# Altium schematic sheet REDS_IO.SchDoc
size A; SheetNumber: 12; SheetTotal: 12
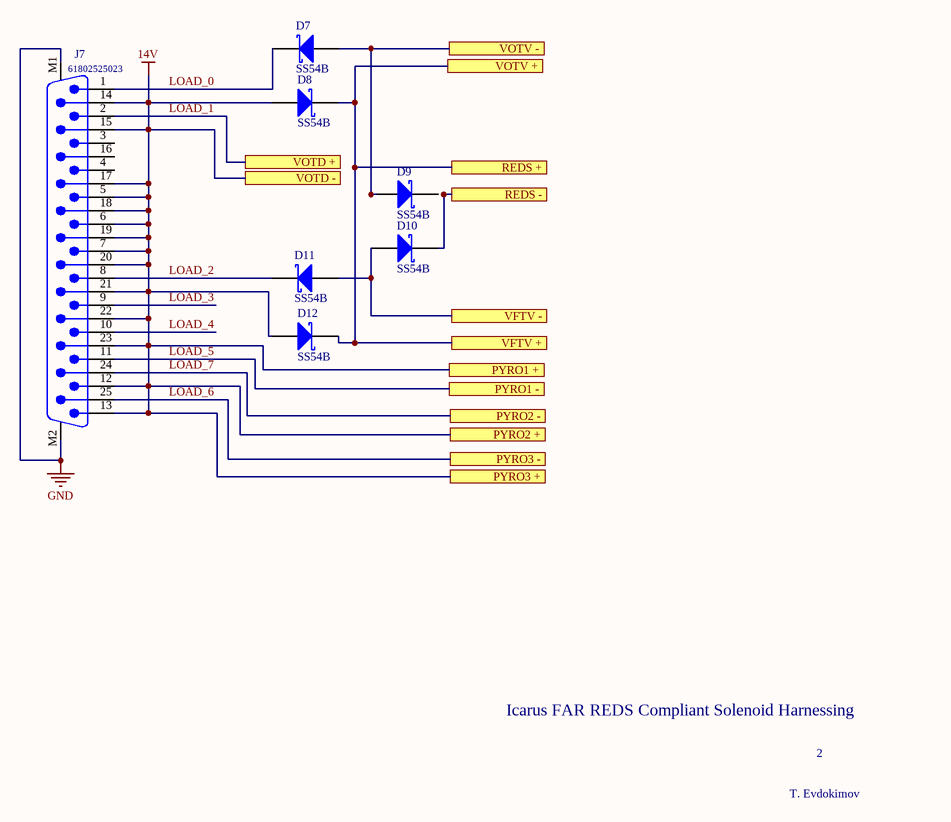
[diagram p0: REDS_IO.SchDoc]

## Parts
D7  SS54B  [JCET-SMB-2_M]
D8  SS54B  [JCET-SMB-2_M]
D9  SS54B  [JCET-SMB-2_M]
D10  SS54B  [JCET-SMB-2_M]
D11  SS54B  [JCET-SMB-2_M]
D12  SS54B  [JCET-SMB-2_M]
J7  61802525023  [61802525023]

## Ports
PYRO1 +, PYRO1 -, PYRO2 +, PYRO2 -, PYRO3 +, PYRO3 -, REDS +, REDS -, VFTV +, VFTV -, VOTD +, VOTD -, VOTV +, VOTV -

## Nets
14V: D8.1(A) D12.1(A) J7.5 J7.6 J7.7 J7.12 J7.13 J7.14 J7.15 J7.17 J7.18 J7.19 J7.20 J7.21 J7.22 J7.23 ; port VOTD -, port PYRO1 +, port PYRO2 +, port PYRO3 +
GND: J7.M1 J7.M2
LOAD_0: D7.2(K) J7.1
LOAD_1: J7.2 ; port VOTD +
LOAD_2: D11.2(K) J7.8
LOAD_3: J7.9
LOAD_4: J7.10
LOAD_5: J7.11 ; port PYRO1 -
LOAD_6: J7.25 ; port PYRO3 -
LOAD_7: J7.24 ; port PYRO2 -
REDS +: D8.2(K) D12.2(K) ; port VOTV +, port VFTV +, port REDS +
REDS -: D10.2(K) ; port REDS -
VFTV -: D10.1(A) D11.1(A) ; port VFTV -
VOTV -: D7.1(A) D9.1(A) ; port VOTV -

Not connected (* = marked no-connect by the designer): D9 2(K); J7 3 4 16

## Notes on the sheet
- Icarus FAR REDS Compliant Solenoid Harnessing
- 2
- T. Evdokimov

## Library data of the parts
D7-D12 = CMP-004-00006-2: Schottky Barrier Rectifier, 40 V, 5 A, -55 to 150 degC, 2-Pin SMD; Manufacturer: JCET; Datasheet URL: http://wiki.seeedstudio.com/images/3/3f/0310130P1.pdf; Datasheet Version: May-13; Package Reference: SMB-2; RoHS Compliant: Unknown; Manufacturer URL: http://www.cj-elec.com/; Mounting Technology: SM; Package Description: 2-Pin Surface Mount Device, Body 4.315 x 3.62 mm; Case/Package: SMB-2
J7 = CMP-1502-00278-1: Male PCB Connector WR-DSUB, Vertical, 25 pins; Manufacturer: Wurth Elektronik; Working Voltage: 125VAC; Rated Current: 3A; Pin Number: 25; Contact Resistance: 30mOhm; Operating Temperature: -40to85degC; Gender: Male; Publisher: WurthElektronik; Packaging: Tray; Orientation: Vertical; Manufacturer URL: http://www.we-online.de; Mounting Technology: THT; Package Reference: 61802525023; Part Number: 61802525023; Datasheet URL: https://katalog.we-online.de/em/datasheet/6180xx25023.pdf